# Altium schematic sheet Hardware Achitecture.SchDoc
size A3; Date: 27.05.2014; DrawnBy: luths8; Organization: BFH; Address1: Bern University of Applied Sciences; Address2: Engineering and Information Technology; Address3: Jlcoweg 1; Address4: CH-3400 Burgdorf; DocumentNumber: 1; Revision: 1.0; SheetNumber: 1; SheetTotal: 19; CurrentDate: 27.05.2014
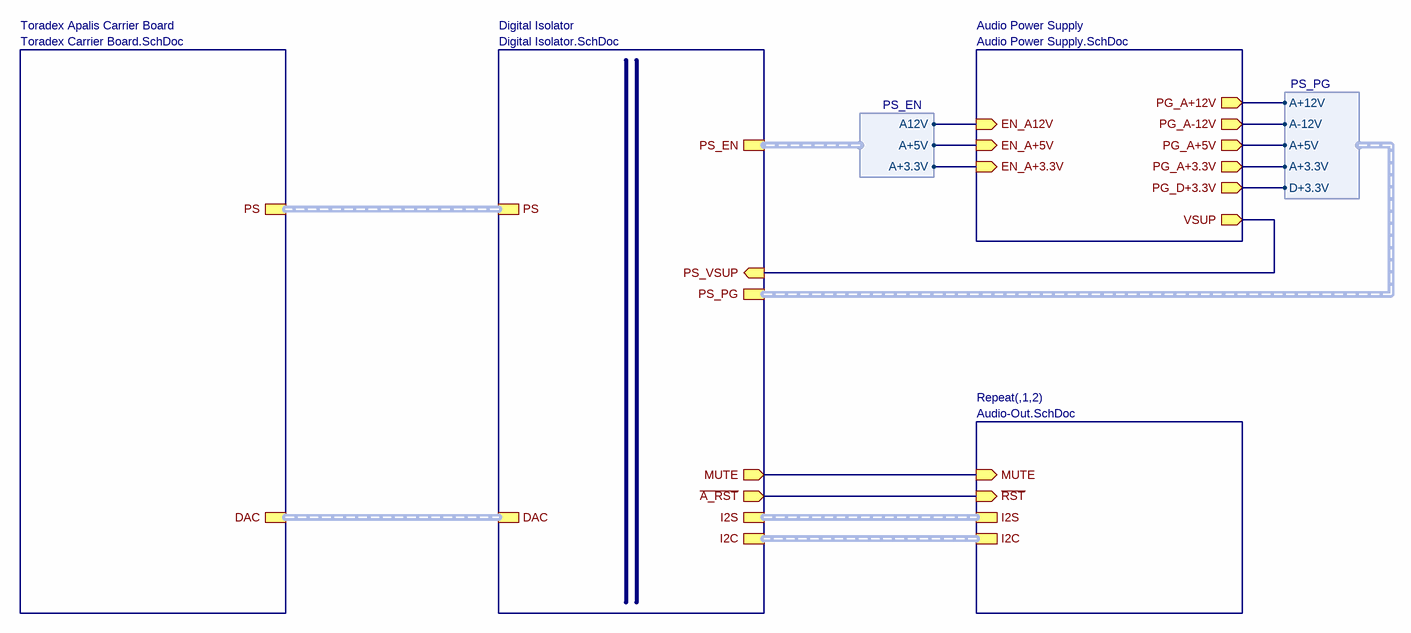
[diagram p0: Hardware Achitecture.SchDoc]

## Sub-sheets
Audio Power Supply = Audio Power Supply.SchDoc: PG_A-12V (out), EN_A12V (in), PG_A+3.3V (out), PG_D+3.3V (out), EN_A+3.3V (in), PG_A+12V (out), VSUP (out), EN_A+5V (in), PG_A+5V (out)
Digital Isolator = Digital Isolator.SchDoc: I2C (harness I2C), I2S (harness I2S), DAC (harness DAC), PS (harness PS), ~{A_RST} (out), MUTE (out), PS_VSUP (in), PS_PG (harness PS_PG), PS_EN (harness PS_EN)
Repeat(,1,2) = Audio-Out.SchDoc: ~{RST} (in), I2S (harness I2S), I2C (harness I2C), MUTE (in)
Toradex Apalis Carrier Board = Toradex Carrier Board.SchDoc: PS (harness PS), DAC (harness DAC)

## Harnesses
PS_EN: A12V, A+3.3V, A+5V
PS_PG: A+12V, A-12V, A+3.3V, D+3.3V, A+5V

## Nets
(unnamed): sheet Repeat(,1,2)/~{RST}, sheet Digital Isolator/~{A_RST}
(unnamed): sheet Repeat(,1,2)/MUTE, sheet Digital Isolator/MUTE
(unnamed): sheet Audio Power Supply/PG_A-12V, sheet Digital Isolator/PS_PG.A-12V
(unnamed): sheet Audio Power Supply/EN_A12V, sheet Digital Isolator/PS_EN.A12V
(unnamed): sheet Audio Power Supply/PG_A+3.3V, sheet Digital Isolator/PS_PG.A+3.3V
(unnamed): sheet Audio Power Supply/PG_D+3.3V, sheet Digital Isolator/PS_PG.D+3.3V
(unnamed): sheet Audio Power Supply/EN_A+3.3V, sheet Digital Isolator/PS_EN.A+3.3V
(unnamed): sheet Audio Power Supply/PG_A+12V, sheet Digital Isolator/PS_PG.A+12V
(unnamed): sheet Audio Power Supply/VSUP, sheet Digital Isolator/PS_VSUP
(unnamed): sheet Audio Power Supply/EN_A+5V, sheet Digital Isolator/PS_EN.A+5V
(unnamed): sheet Audio Power Supply/PG_A+5V, sheet Digital Isolator/PS_PG.A+5V

## Buses and harness runs
harness sheet Digital Isolator/DAC = sheet Toradex Apalis Carrier Board/DAC
harness sheet Digital Isolator/I2C = sheet Repeat(,1,2)/I2C
harness sheet Digital Isolator/I2S = sheet Repeat(,1,2)/I2S
harness sheet Digital Isolator/PS = sheet Toradex Apalis Carrier Board/PS

## Notes on the sheet
- Project:
- Size:
- Sheet:
- Title:
- A3
- of
- Drawn by:
- Revision:
- Date:
- Variant:
- b
- File: